# EAGLE design AVRI2CIO_V0_3_LEVEL1 (EAGLE 6.5.0)
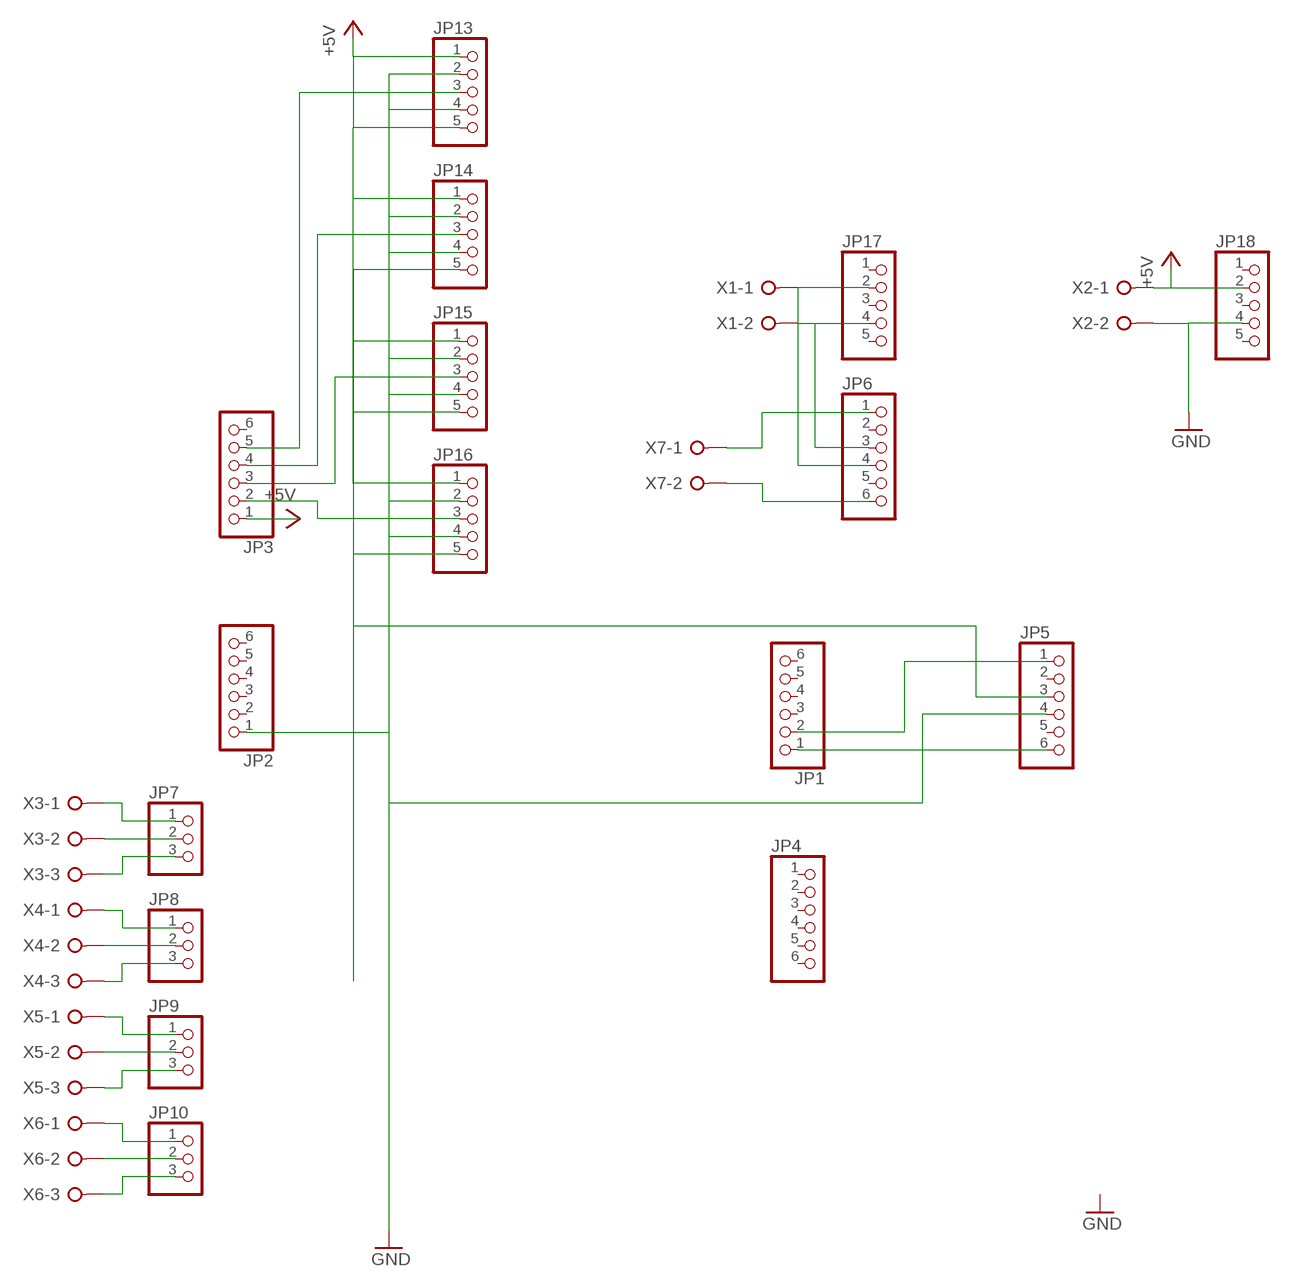
[diagram p0: schematic, sheet 1]

## Parts
JP1  PINHD-1X6  [1X06]
JP2  PINHD-1X6  [1X06]
JP3  PINHD-1X6  [1X06]
JP4  PINHD-1X6  [1X06]
JP5  PINHD-1X6  [1X06]
JP6  PINHD-1X6  [1X06]
JP7  PINHD-1X3  [1X03]
JP8  PINHD-1X3  [1X03]
JP9  PINHD-1X3  [1X03]
JP10  PINHD-1X3  [1X03]
JP13  PINHD-1X5  [1X05]
JP14  PINHD-1X5  [1X05]
JP15  PINHD-1X5  [1X05]
JP16  PINHD-1X5  [1X05]
JP17  PINHD-1X5  [1X05]
JP18  PINHD-1X5  [1X05]
X1  W237-02P  [W237-132]
X2  W237-02P  [W237-132]
X3  W237-3E  [W237-3E]
X4  W237-3E  [W237-3E]
X5  W237-3E  [W237-3E]
X6  W237-3E  [W237-3E]
X7  W237-02P  [W237-132]

## Nets
+5V: JP3.1 JP5.3 JP13.1 JP13.5 JP14.5 JP15.1 JP15.5 JP16.1 JP16.5 JP18.2 X2.1
GND: JP2.1 JP5.4 JP13.2 JP13.4 JP14.2 JP14.4 JP15.2 JP15.4 JP16.2 JP16.4 JP18.4 X2.2
N$1: JP3.3 JP15.3
N$2: JP3.4 JP14.3
N$3: JP3.5 JP13.3
N$11: JP3.2 JP16.3
N$13: JP10.2 X6.2
N$14: JP10.1 X6.1
N$15: JP10.3 X6.3
N$16: JP9.3 X5.3
N$17: JP9.2 X5.2
N$18: JP9.1 X5.1
N$19: JP8.3 X4.3
N$20: JP8.2 X4.2
N$21: JP8.1 X4.1
N$22: JP7.3 X3.3
N$23: JP7.2 X3.2
N$24: JP7.1 X3.1
N$26: JP14.1
N$35: JP1.2 JP5.1
N$36: JP1.1 JP5.6
N$37: JP6.4 JP17.2 X1.1
N$40: JP6.3 JP17.4 X1.2
N$42: JP6.1 X7.1
N$43: JP6.6 X7.2
Unconnected: JP1.3 JP1.4 JP1.5 JP1.6 JP2.2 JP2.3 JP2.4 JP2.5 JP2.6 JP3.6 JP4.1 JP4.2 JP4.3 JP4.4 JP4.5 JP4.6 JP5.2 JP5.5 JP6.2 JP6.5 JP17.1 JP17.3 JP17.5 JP18.1 JP18.3 JP18.5

## Library data of the parts
JP1-JP6 = pinhead:PINHD-1X6: PIN HEADER
JP7-JP10 = pinhead:PINHD-1X3: PIN HEADER
JP13-JP18 = pinhead:PINHD-1X5: PIN HEADER
X1 X2 X7 = con-wago-508:W237-02P: WAGO SREW CLAMP; OC_FARNELL: unknown; OC_NEWARK: unknown
X3-X6 = con-wago-508:W237-3E: WAGO SREW CLAMP; OC_FARNELL: unknown; OC_NEWARK: unknown

## Board
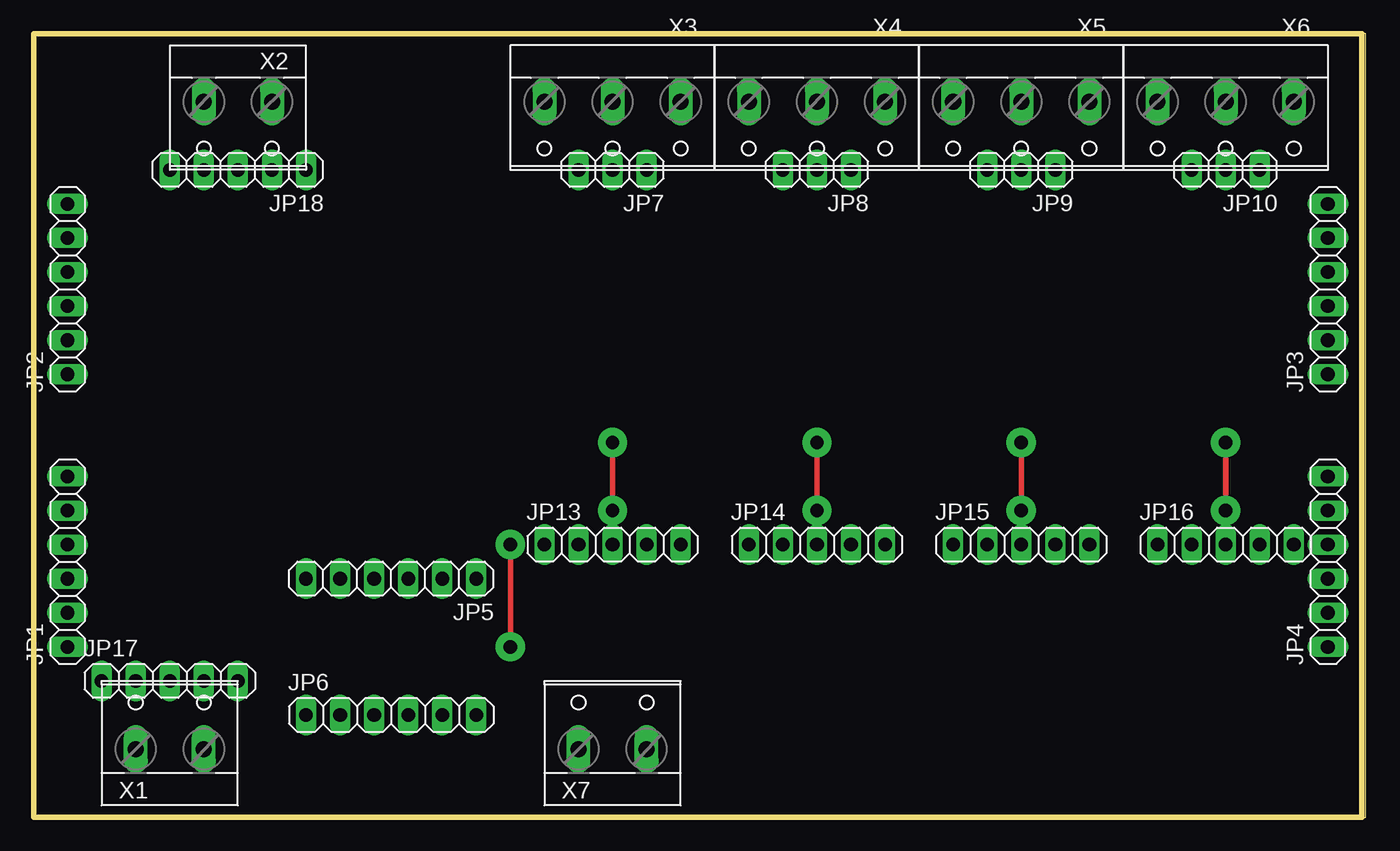
[diagram p1: board, top side]
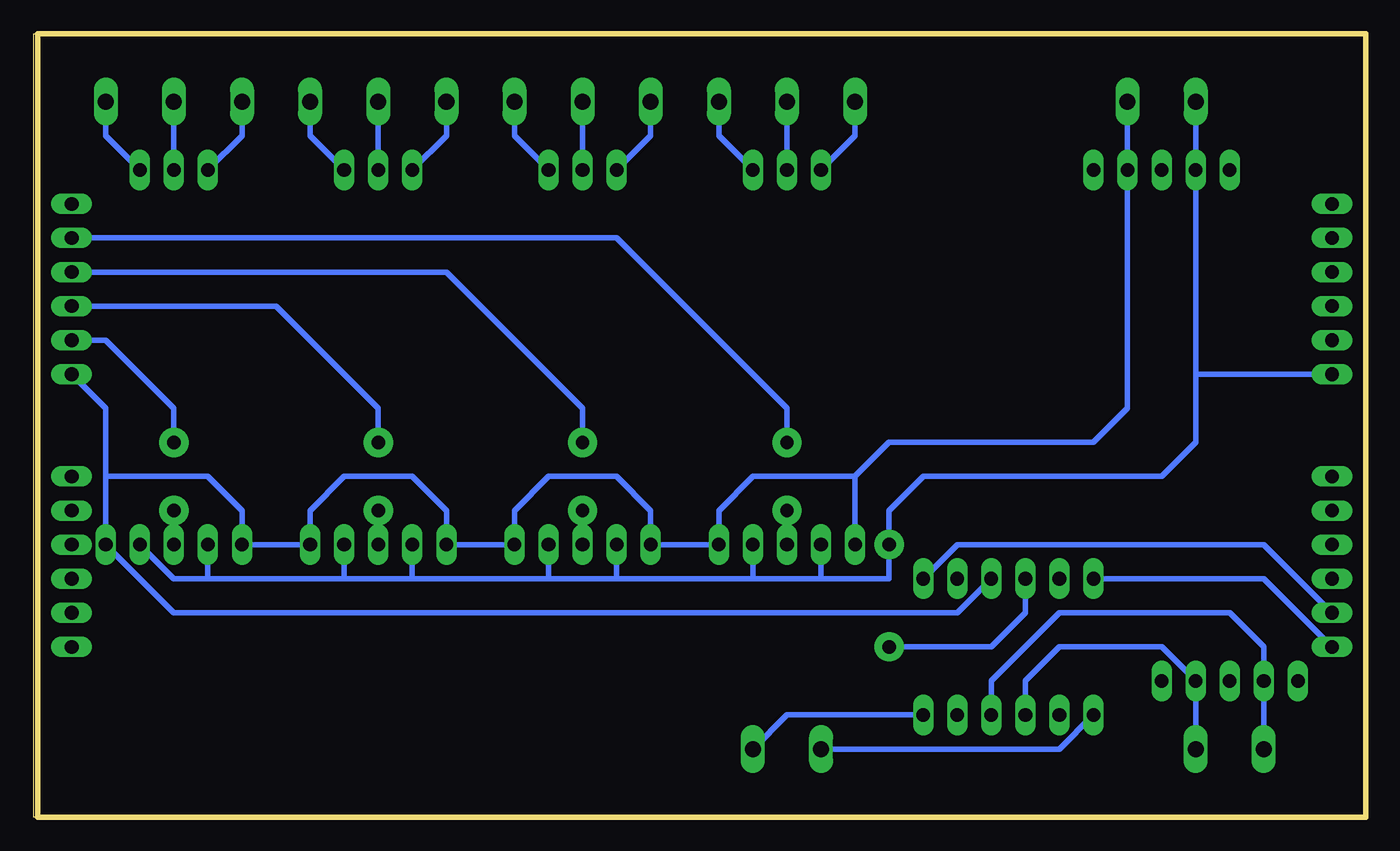
[diagram p2: board, bottom side, seen from below]

Size 99.36 x 58.42 mm. Coordinates in mm from the lower left corner, seen from the top.
Outline: 99.06,0 99.36,0 99.36,58.41 0,58.41
Outline: 0,58.41 0,58.42 99.06,58.42 99.06,0
Outline: 0,58.41 0,0 99.06,0
Copper layers (1*16): Top 0.035mm / dielectric 1.5mm / Bottom 0.035mm
Design rules "default": minimum track width 10mil, minimum drill 24mil, track to track 8mil, track to pad 8mil, pad to pad 8mil, via to via 8mil, smd to smd 8mil, copper to edge 40mil, drill to drill 8mil, minimum pad ring 10mil, minimum via ring 8mil, stop-mask expansion 4mil, vias tented up to drill 0mil, thermal gap 10mil

### Footprints (pad centres in the part's own frame; a part is rotated, then mirrored left to right if it is on the bottom)
1X06 = drill 1.016 long: 1 -6.35,0; 2 -3.81,0; 3 -1.27,0; 4 1.27,0; 5 3.81,0; 6 6.35,0
1X03 = drill 1.016 long: 1 -2.54,0; 2 0,0; 3 2.54,0
1X05 = drill 1.016 long: 1 -5.08,0; 2 -2.54,0; 3 0,0; 4 2.54,0; 5 5.08,0
W237-132 = drill 1.194 long: 1 -2.54,-0.635; 2 2.54,-0.635
W237-3E = drill 1.194 long: 1 -5.08,-0.635; 2 0,-0.635; 3 5.08,-0.635

### Placement (x,y rotation side)
JP1  2.54,19.05 90 top
JP2  2.54,39.37 90 top
JP3  96.52,39.37 90 top
JP4  96.52,19.05 90 top
JP5  26.67,17.78 180 top
JP6  26.67,7.62 0 top
JP7  43.18,48.26 180 top
JP8  58.42,48.26 180 top
JP9  73.66,48.26 180 top
JP10  88.9,48.26 180 top
JP13  43.18,20.32 0 top
JP14  58.42,20.32 0 top
JP15  73.66,20.32 0 top
JP16  88.9,20.32 0 top
JP17  10.16,10.16 0 top
JP18  15.24,48.26 180 top
X1  10.16,5.71 0 top
X2  15.24,52.7 180 top
X3  43.18,52.7 180 top
X4  58.42,52.7 180 top
X5  73.66,52.7 180 top
X6  88.9,52.7 180 top
X7  43.18,5.71 0 top

### Tracks (layer width: path | path; a pad name or v marks a point on that pad's centre or on a via)
+5V
  Bottom 0.406: JP3.1 93.98,30.48 93.98,25.4 | 38.1,25.4 45.72,25.4 48.26,22.86 JP13.5 53.34,20.32 53.34,22.86 55.88,25.4 60.96,25.4 63.5,22.86 JP14.5 JP15.1 68.58,22.86 71.12,25.4 76.2,25.4 78.74,22.86 JP15.5 JP16.1 83.82,22.86 86.36,25.4 93.98,25.4 | 38.1,25.4 JP13.1 | JP5.3 30.48,15.24 88.9,15.24 JP16.5 93.98,25.4 | 38.1,25.4 35.56,27.94 20.32,27.94 17.78,30.48 JP18.2 X2.1
GND  (via drill 1 pad 2.18)
  Top 0.406: v35.56,12.7 v35.56,20.32
  Bottom 0.406: JP2.1 12.7,33.02 | 12.7,33.02 12.7,27.94 15.24,25.4 33.02,25.4 35.56,22.86 v35.56,20.32 35.56,17.78 40.64,17.78 | JP13.2 40.64,17.78 | 40.64,17.78 45.72,17.78 | JP13.4 45.72,17.78 | 45.72,17.78 55.88,17.78 | 55.88,17.78 60.96,17.78 | JP14.2 55.88,17.78 | JP14.4 60.96,17.78 | 60.96,17.78 71.12,17.78 | JP15.2 71.12,17.78 | 71.12,17.78 76.2,17.78 | JP15.4 76.2,17.78 | 76.2,17.78 86.36,17.78 | JP16.2 86.36,17.78 | 86.36,17.78 88.9,17.78 JP16.4 | X2.2 JP18.4 12.7,33.02 | JP5.4 25.4,15.24 27.94,12.7 v35.56,12.7
N$1  (via drill 1 pad 2.18)
  Top 0.406: v73.66,22.86 v73.66,27.94
  Bottom 0.406: JP3.3 81.28,38.1 73.66,30.48 v73.66,27.94 | JP15.3 v73.66,22.86
N$2  (via drill 1 pad 2.18)
  Top 0.406: v58.42,22.86 v58.42,27.94
  Bottom 0.406: JP3.4 68.58,40.64 58.42,30.48 v58.42,27.94 | JP14.3 v58.42,22.86
N$3  (via drill 1 pad 2.18)
  Top 0.406: v43.18,22.86 v43.18,27.94
  Bottom 0.406: JP13.3 v43.18,22.86 | v43.18,27.94 43.18,30.48 55.88,43.18 JP3.5
N$11  (via drill 1 pad 2.18)
  Top 0.406: v88.9,22.86 v88.9,27.94
  Bottom 0.406: JP16.3 v88.9,22.86 | v88.9,27.94 88.9,30.48 93.98,35.56 JP3.2
N$13
  Bottom 0.406: JP10.2 X6.2
N$14
  Bottom 0.406: JP10.1 93.98,50.8 X6.1
N$15
  Bottom 0.406: JP10.3 83.82,50.8 X6.3
N$16
  Bottom 0.406: JP9.3 68.58,50.8 X5.3
N$17
  Bottom 0.406: JP9.2 X5.2
N$18
  Bottom 0.406: JP9.1 78.74,50.8 X5.1
N$19
  Bottom 0.406: JP8.3 53.34,50.8 X4.3
N$20
  Bottom 0.406: JP8.2 X4.2
N$21
  Bottom 0.406: JP8.1 63.5,50.8 X4.1
N$22
  Bottom 0.406: JP7.3 38.1,50.8 X3.3
N$23
  Bottom 0.406: JP7.2 X3.2
N$24
  Bottom 0.406: JP7.1 48.26,50.8 X3.1
N$25  (via drill 1 pad 2.18)
  other vias: 58.42,22.86
N$27  (via drill 1 pad 2.18)
  other vias: 73.66,22.86
N$28  (via drill 1 pad 2.18)
  other vias: 88.9,22.86
N$30  (via drill 1 pad 2.18)
  other vias: 58.42,27.94
N$31  (via drill 1 pad 2.18)
  other vias: 73.66,27.94
N$32  (via drill 1 pad 2.18)
  other vias: 88.9,27.94
N$33  (via drill 1 pad 2.18)
  other vias: 43.18,22.86
N$34  (via drill 1 pad 2.18)
  other vias: 43.18,27.94
N$35
  Bottom 0.406: JP1.2 7.62,20.32 30.48,20.32 JP5.1
N$36
  Bottom 0.406: JP1.1 7.62,17.78 JP5.6
N$37
  Bottom 0.406: X1.1 JP17.2 7.62,12.7 10.16,15.24 22.86,15.24 27.94,10.16 JP6.4
N$38  (via drill 1 pad 2.18)
  other vias: 35.56,20.32
N$40
  Bottom 0.406: X1.2 JP17.4 15.24,12.7 22.86,12.7 25.4,10.16 JP6.3
N$42
  Bottom 0.406: JP6.1 22.86,5.08 X7.1
N$43
  Bottom 0.406: JP6.6 43.18,7.62 X7.2